# Altium schematic sheet MotorDriver.Mikroe.SchDoc
size 297 x 209 mm; Revision: 1; SheetNumber: 3; SheetTotal: 3; swcgroup: FabLab; Org: Sainsbury Wellcome Centre; Add1: 25 Howland Street; Add2: London; Add3: W1T 4JG; WebAddress: www.sainsburywellcome.org; SheetSize: A4; SheetName: Mikroe Motor Click 5 interface
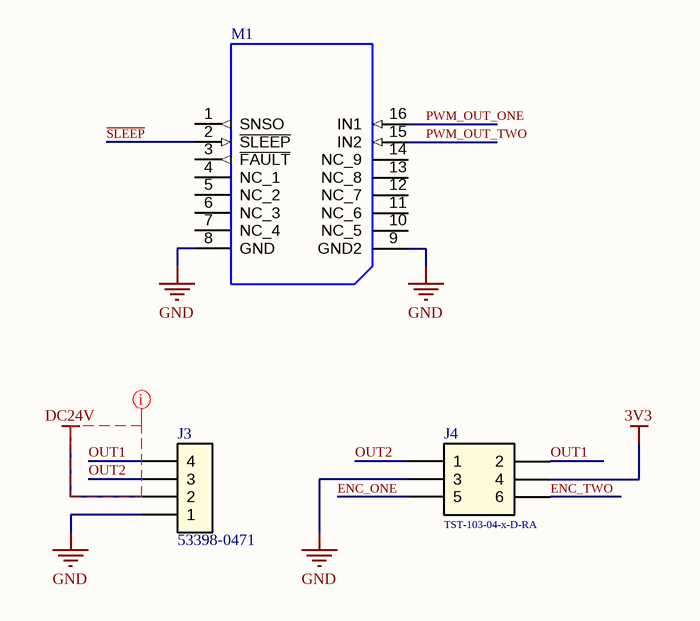
[diagram p0: MotorDriver.Mikroe.SchDoc]

## Parts
J3  53398-0471  [FP-533980471-MFG]
J4  TST-103-04-x-D-RA  [SAMTEC_TST-103-04-G-D-RA]
M1  MIKROE-2699  [MIKROE-M]  (value not drawn)

## Nets
3V3: J4.4
DC24V: J3.2
GND: J3.1 J4.3 M1.8(GND) M1.9(GND2)
~{SLEEP}: M1.2(~{SLEEP})
ENC_ONE: J4.5
ENC_TWO: J4.6
OUT1: J3.4 J4.2
OUT2: J3.3 J4.1
PWM_OUT_ONE: M1.16(IN1)
PWM_OUT_TWO: M1.15(IN2)

Not connected (* = marked no-connect by the designer): M1 1(SNSO) 3(~{FAULT}) 4(NC_1) 5(NC_2) 6(NC_3) 7(NC_4) 10(NC_5) 11(NC_6) 12(NC_7) 13(NC_8) 14(NC_9)

## Layout directives
net class Power Nets: DC24V, OUT1, OUT2

## Notes on the sheet
- FILE
- VARIANT
- DATE
- REVISION
- SHEET
- /
- PROJECT
- SIZE

## Library data of the parts
J3 = CMP-370-0030-2: Board Connector, 4 Contact(s), 1 Row(s), Male, Straight, 0.049 inch Pitch, Surface Mount Terminal, Locking, Natural Insulator, Receptacle; Polarization Key: POLARIZED HOUSING; Number of Contacts: 4; DIN Conformance: No; Reference Standard: UL; Plating Thickness: 39uin; Mating Information: MULTIPLE MATING PARTS AVAILABLE; Durability: 30Cycles; Body Length: 0.383inch; Contact Pattern: RECTANGULAR; Option: General Purpose; Reliability: COMMERCIAL; Number of Rows Loaded: 1; Dielectric Withstanding Voltage (AC): 250V; Board Mounting Option: FITTING NAIL; Body Breadth: 0.146inch; Contact Resistance: 20mR; Insulation Resistance: 100MR; Rated Current (Signal): 1A; Body Depth: 0.185inch; Contact Style: Blade Pin; Contact Finish - Termination: Matte Tin (Sn) - with Nickel (Ni) barrier; Contact Material: Bronze; Mount: Board; Max Operating Temperature: 85°C; Contact Gender: Male; Connector Type: BOARD CONNECTOR; Termination: SMD/SMT; Mounting Style: STRAIGHT; Insulation Material: Polyamide; Min Operating Temperature: -40°C; IEC Conformance: No; Contact Finish - Mating: MATTE TIN (39) OVER NICKEL; PartNumber: 53398-0471; Filter Feature: No; Body/Shell Style: RECEPTACLE; RoHS Compliant: Yes; MIL Conformance: No; JESD-609 Code: e3; Number Of PCB Rows: 1; Mating Contact Pitch: 0.049inch; Flammability Rating: UL94 V-0; PCB Contact Pattern: RECTANGULAR; Insulation Color: Natural; Number Of Connectors: 1; Mounting Option 1: LOCKING; Mixed Contacts: No; Terminal Pitch: 1.25mm; REACH SVHC: Yes
J4 = CMP-370-0023-6: Board Connector, 6 Contact(s), 2 Row(s), Male, Right Angle, Solder Terminal; PartNumber: TST-103-04-G-D-RA; Number of Contacts: 6; Pitch: 2.54; Mount: Through Hole; Number of Rows: 2
M1 = CMP-A10-0003-3: DRV8701 Brushed DC Motor Full-Bridge Gate DC Motor Driver 5 Click Add-On Board